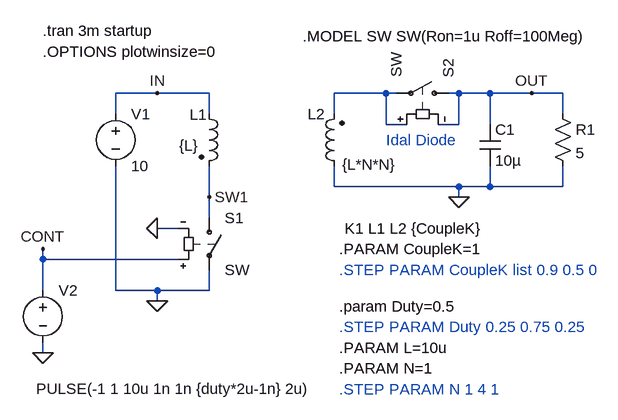
[diagram p0: schematic Fig_7-24_Flyback_Ideal_1-N_D-STEP.asc]
Fig_7-24_Flyback_Ideal_1-N_D-STEP.asc, the LTspice schematic file:
Version 4
SHEET 1 940 1020
WIRE 128 32 64 32
WIRE 208 32 128 32
WIRE 480 32 400 32
WIRE 496 32 480 32
WIRE 592 32 576 32
WIRE 640 32 592 32
WIRE 704 32 640 32
WIRE 752 32 704 32
WIRE 64 64 64 32
WIRE 208 64 208 32
WIRE 400 64 400 32
WIRE 752 64 752 32
WIRE 480 80 480 32
WIRE 512 80 480 80
WIRE 592 80 592 32
WIRE 592 80 560 80
WIRE 640 80 640 32
WIRE 400 176 400 144
WIRE 592 176 400 176
WIRE 640 176 640 144
WIRE 640 176 592 176
WIRE 752 176 752 144
WIRE 752 176 640 176
WIRE 208 192 208 144
WIRE 592 192 592 176
WIRE 208 224 208 192
WIRE 160 240 128 240
WIRE -48 288 -48 272
WIRE 160 288 -48 288
WIRE -48 336 -48 288
WIRE 64 336 64 144
WIRE 128 336 64 336
WIRE 208 336 208 304
WIRE 208 336 128 336
WIRE 128 352 128 336
WIRE -48 432 -48 416
FLAG 128 352 0
FLAG 592 192 0
FLAG 128 240 0
FLAG -48 272 CONT
FLAG -48 432 0
FLAG 208 192 SW1
FLAG 128 32 IN
FLAG 704 32 OUT
SYMBOL voltage 64 48 R0
WINDOW 123 0 0 Left 2
WINDOW 39 0 0 Left 2
SYMATTR InstName V1
SYMATTR Value 10
SYMBOL ind2 192 48 R0
WINDOW 0 -14 17 Left 2
WINDOW 3 -30 65 Left 2
SYMATTR InstName L1
SYMATTR Value {L}
SYMATTR Type ind
SYMBOL ind2 416 160 R180
WINDOW 0 30 96 Left 2
WINDOW 3 -79 18 Left 2
SYMATTR InstName L2
SYMATTR Value {L*N*N}
SYMATTR Type ind
SYMBOL res 736 48 R0
SYMATTR InstName R1
SYMATTR Value 5
SYMBOL sw 208 208 R0
SYMATTR InstName S1
SYMBOL voltage -48 320 R0
WINDOW 3 -10 167 Left 2
WINDOW 123 0 0 Left 2
WINDOW 39 0 0 Left 2
SYMATTR Value PULSE(-1 1 10u 1n 1n {duty*2u-1n} 2u)
SYMATTR InstName V2
SYMBOL cap 624 80 R0
SYMATTR InstName C1
SYMATTR Value 10µ
SYMBOL sw 592 32 M270
SYMATTR InstName S2
TEXT -48 -64 Left 2 !.tran 3m startup
TEXT 352 -56 Left 2 !.MODEL SW SW(Ron=1u Roff=100Meg)
TEXT 408 360 Left 2 !.param Duty=0.5
TEXT 416 240 Left 2 !K1 L1 L2 {CoupleK}
TEXT 408 488 Left 2 ;.STEP PARAM N 1 4 1
TEXT 480 104 Left 2 ;Idal Diode
TEXT 408 424 Left 2 !.PARAM L=10u
TEXT -48 -32 Left 2 !.OPTIONS plotwinsize=0
TEXT 408 392 Left 2 ;.STEP PARAM Duty 0.25 0.75 0.25
TEXT 408 456 Left 2 !.PARAM N=1
TEXT 408 304 Left 2 ;.STEP PARAM CoupleK list 0.9 0.5 0
TEXT 408 272 Left 2 !.PARAM CoupleK=1

The netlist it stands for:
* Fig_7-24_Flyback_Ideal_1-N_D-STEP.asc
V1 IN 0 10
L1 IN SW1 {L}
L2 0 N001 {L*N*N}
R1 OUT 0 5
S1 SW1 0 CONT 0 SW
V2 CONT 0 PULSE(-1 1 10u 1n 1n {duty*2u-1n} 2u)
C1 OUT 0 10µ
S2 OUT N001 N001 OUT SW
.tran 3m startup
.MODEL SW SW(Ron=1u Roff=100Meg)
.param Duty=0.5
K1 L1 L2 {CoupleK}
* .STEP PARAM N 1 4 1
* Idal Diode
.PARAM L=10u
.OPTIONS plotwinsize=0
* .STEP PARAM Duty 0.25 0.75 0.25
.PARAM N=1
* .STEP PARAM CoupleK list 0.9 0.5 0
.PARAM CoupleK=1
.backanno
.end